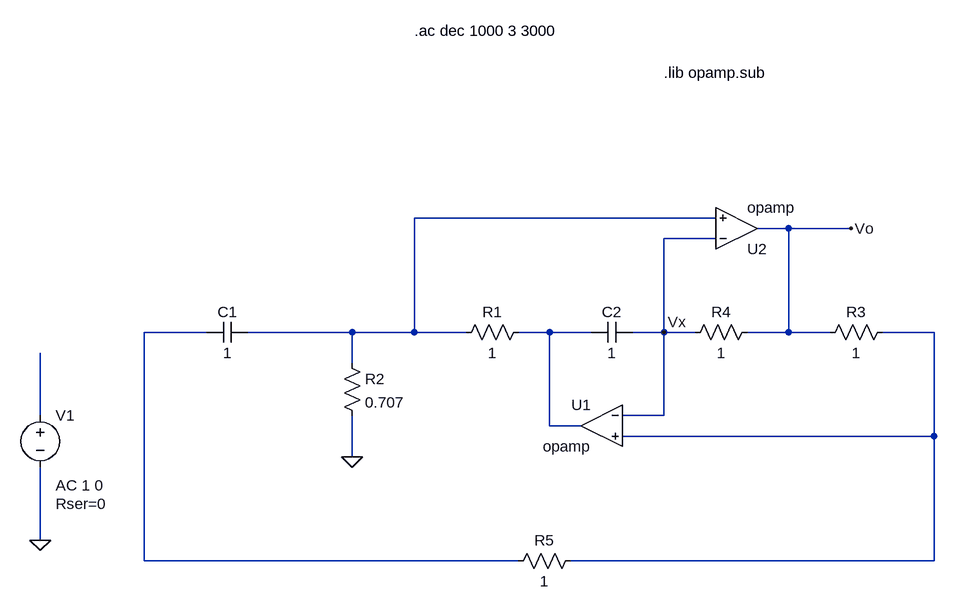
[diagram p0: schematic Circuito_2d.asc]
Circuito_2d.asc, the LTspice schematic file:
Version 4
SHEET 1 1016 680
WIRE 448 -16 -16 -16
WIRE 560 0 512 0
WIRE 656 0 560 0
WIRE 448 16 368 16
WIRE -336 160 -432 160
WIRE -112 160 -272 160
WIRE -16 160 -16 -16
WIRE -16 160 -112 160
WIRE 64 160 -16 160
WIRE 192 160 144 160
WIRE 256 160 192 160
WIRE 368 160 368 16
WIRE 368 160 320 160
WIRE 416 160 368 160
WIRE 560 160 560 0
WIRE 560 160 496 160
WIRE 624 160 560 160
WIRE 784 160 704 160
WIRE -112 208 -112 160
WIRE -592 288 -592 192
WIRE 368 288 368 160
WIRE 368 288 304 288
WIRE 192 304 192 160
WIRE 240 304 192 304
WIRE 784 320 784 160
WIRE 784 320 304 320
WIRE -112 352 -112 288
WIRE -592 480 -592 368
WIRE -432 512 -432 160
WIRE 144 512 -432 512
WIRE 784 512 784 320
WIRE 784 512 224 512
FLAG -112 352 0
FLAG 656 0 Vo
FLAG -592 480 0
FLAG 368 160 Vx
SYMBOL res -128 192 R0
SYMATTR InstName R2
SYMATTR Value 0.707
SYMBOL res 160 144 R90
WINDOW 0 0 56 VBottom 2
WINDOW 3 32 56 VTop 2
SYMATTR InstName R1
SYMATTR Value 1
SYMBOL res 720 144 R90
WINDOW 0 0 56 VBottom 2
WINDOW 3 32 56 VTop 2
SYMATTR InstName R3
SYMATTR Value 1
SYMBOL res 512 144 R90
WINDOW 0 0 56 VBottom 2
WINDOW 3 32 56 VTop 2
SYMATTR InstName R4
SYMATTR Value 1
SYMBOL res 240 496 R90
WINDOW 0 0 56 VBottom 2
WINDOW 3 32 56 VTop 2
SYMATTR InstName R5
SYMATTR Value 1
SYMBOL cap -272 144 R90
WINDOW 0 0 32 VBottom 2
WINDOW 3 32 32 VTop 2
SYMATTR InstName C1
SYMATTR Value 1
SYMATTR SpiceLine Rser=0
SYMBOL cap 320 144 R90
WINDOW 0 0 32 VBottom 2
WINDOW 3 32 32 VTop 2
SYMATTR InstName C2
SYMATTR Value 1
SYMATTR SpiceLine Rser=0
SYMBOL OpAmps\\opamp 272 240 M0
SYMATTR InstName U1
SYMBOL OpAmps\\opamp 480 64 M180
SYMATTR InstName U2
SYMBOL voltage -592 272 R0
WINDOW 123 24 124 Left 2
WINDOW 39 24 152 Left 2
SYMATTR Value2 AC 1 0
SYMATTR SpiceLine Rser=0
SYMATTR InstName V1
SYMATTR Value ""
TEXT 368 -240 Left 2 !.lib opamp.sub
TEXT -16 -304 Left 2 !.ac dec 1000 3 3000

The netlist it stands for:
* Circuito_2d.asc
R2 N001 0 0.707
R1 N003 N001 1
R3 N004 Vo 1
R4 Vo Vx 1
R5 N004 N002 1
C1 N001 N002 1 Rser=0
C2 Vx N003 1 Rser=0
XU1 Vx N004 N003 opamp Aol=100K GBW=10Meg  ; pins invin noninvin out
XU2 Vx N001 Vo opamp Aol=100K GBW=10Meg  ; pins invin noninvin out
V1 N005 0 AC 1 0 Rser=0
.lib opamp.sub
.ac dec 1000 3 3000
.backanno
.end